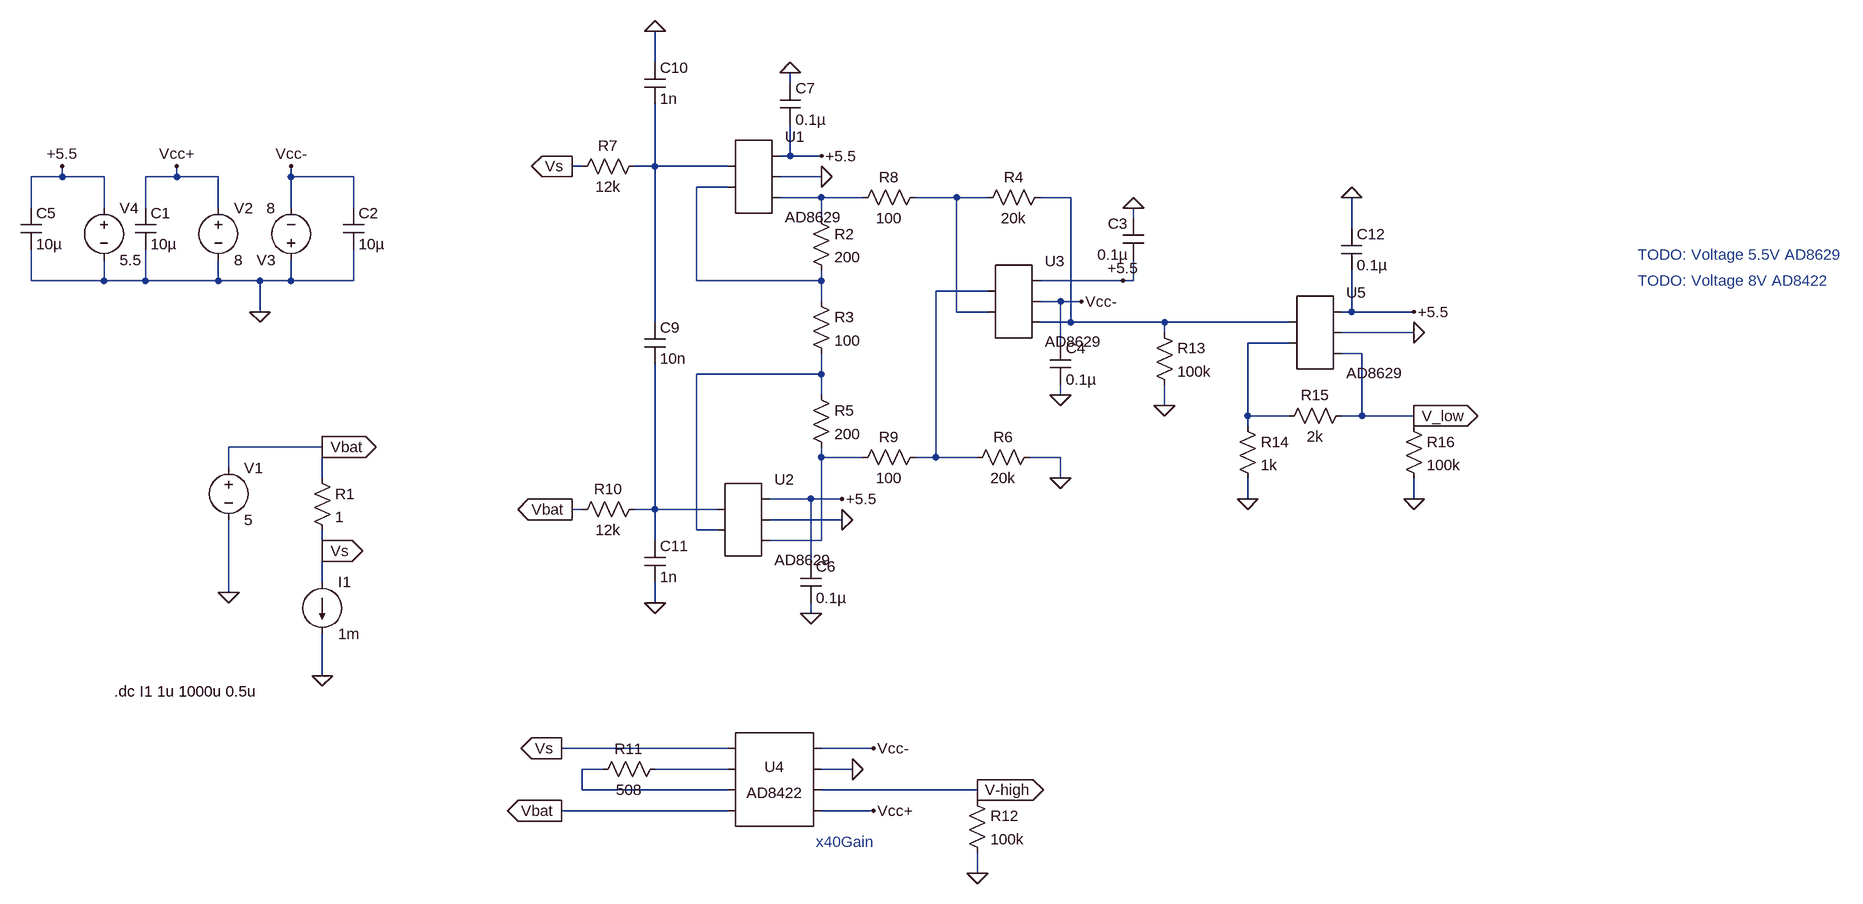
[diagram p0: schematic cm_AD8629.asc]
cm_AD8629.asc, the LTspice schematic file:
Version 4
SHEET 1 1660 912
WIRE -176 -720 -176 -768
WIRE 32 -688 32 -704
WIRE 32 -576 32 -624
WIRE 32 -576 16 -576
WIRE 80 -576 32 -576
WIRE -288 -560 -304 -560
WIRE -176 -560 -176 -656
WIRE -176 -560 -208 -560
WIRE -64 -560 -176 -560
WIRE -1088 -544 -1088 -560
WIRE -1088 -544 -1136 -544
WIRE -1024 -544 -1088 -544
WIRE -912 -544 -912 -560
WIRE -912 -544 -960 -544
WIRE -848 -544 -912 -544
WIRE -736 -544 -736 -560
WIRE -640 -544 -736 -544
WIRE 80 -544 16 -544
WIRE -64 -528 -112 -528
WIRE 80 -512 16 -512
WIRE 144 -512 80 -512
WIRE 288 -512 224 -512
WIRE 336 -512 288 -512
WIRE 464 -512 416 -512
WIRE -1136 -496 -1136 -544
WIRE -1024 -496 -1024 -544
WIRE -960 -496 -960 -544
WIRE -848 -496 -848 -544
WIRE -736 -496 -736 -544
WIRE -640 -496 -640 -544
WIRE 80 -480 80 -512
WIRE 560 -480 560 -496
WIRE 896 -464 896 -512
WIRE -1136 -384 -1136 -432
WIRE -1024 -384 -1024 -416
WIRE -1024 -384 -1136 -384
WIRE -960 -384 -960 -432
WIRE -960 -384 -1024 -384
WIRE -848 -384 -848 -416
WIRE -848 -384 -960 -384
WIRE -784 -384 -848 -384
WIRE -736 -384 -736 -416
WIRE -736 -384 -784 -384
WIRE -640 -384 -640 -432
WIRE -640 -384 -736 -384
WIRE -112 -384 -112 -528
WIRE 80 -384 80 -400
WIRE 80 -384 -112 -384
WIRE 544 -384 416 -384
WIRE 560 -384 560 -416
WIRE 560 -384 544 -384
WIRE 336 -368 256 -368
WIRE 80 -352 80 -384
WIRE 448 -352 416 -352
WIRE 480 -352 448 -352
WIRE -784 -336 -784 -384
WIRE 288 -336 288 -512
WIRE 336 -336 288 -336
WIRE 896 -336 896 -400
WIRE 896 -336 880 -336
WIRE 992 -336 896 -336
WIRE -176 -320 -176 -560
WIRE 464 -320 464 -512
WIRE 464 -320 416 -320
WIRE 608 -320 464 -320
WIRE 800 -320 608 -320
WIRE 608 -304 608 -320
WIRE 992 -304 880 -304
WIRE 448 -288 448 -352
WIRE 800 -288 736 -288
WIRE 912 -272 880 -272
WIRE 80 -240 80 -272
WIRE 80 -240 -112 -240
WIRE 80 -208 80 -240
WIRE 448 -208 448 -224
WIRE 608 -192 608 -224
WIRE 736 -176 736 -288
WIRE 800 -176 736 -176
WIRE 912 -176 912 -272
WIRE 912 -176 880 -176
WIRE 992 -176 912 -176
WIRE 736 -160 736 -176
WIRE 992 -160 992 -176
WIRE -688 -128 -832 -128
WIRE 80 -112 80 -128
WIRE 144 -112 80 -112
WIRE 256 -112 256 -368
WIRE 256 -112 224 -112
WIRE 320 -112 256 -112
WIRE 448 -112 400 -112
WIRE -832 -96 -832 -128
WIRE -688 -80 -688 -128
WIRE 448 -80 448 -112
WIRE 64 -48 0 -48
WIRE 112 -48 64 -48
WIRE 736 -48 736 -80
WIRE 992 -48 992 -80
WIRE -288 -32 -304 -32
WIRE -176 -32 -176 -256
WIRE -176 -32 -208 -32
WIRE -80 -32 -176 -32
WIRE 112 -16 0 -16
WIRE -112 0 -112 -240
WIRE -80 0 -112 0
WIRE -176 16 -176 -32
WIRE 80 16 80 -112
WIRE 80 16 0 16
WIRE -688 32 -688 0
WIRE 64 48 64 -48
WIRE -688 80 -688 32
WIRE -832 96 -832 -16
WIRE -176 112 -176 80
WIRE 64 128 64 112
WIRE -688 224 -688 160
WIRE -64 336 -320 336
WIRE 160 336 80 336
WIRE -256 368 -288 368
WIRE -64 368 -176 368
WIRE 128 368 80 368
WIRE -288 400 -288 368
WIRE -64 400 -288 400
WIRE 320 400 80 400
WIRE 320 416 320 400
WIRE -64 432 -320 432
WIRE 160 432 80 432
WIRE 320 528 320 496
FLAG -832 96 0
FLAG -688 224 0
FLAG -784 -336 0
FLAG -912 -560 Vcc+
FLAG -688 -128 Vbat
IOPIN -688 -128 Out
FLAG -688 32 Vs
IOPIN -688 32 Out
FLAG 112 -48 +5.5
FLAG 80 -576 +5.5
FLAG 544 -384 +5.5
FLAG 448 -80 0
FLAG -736 -560 Vcc-
FLAG 480 -352 Vcc-
FLAG -304 -32 Vbat
IOPIN -304 -32 Out
FLAG -304 -560 Vs
IOPIN -304 -560 Out
FLAG 80 -544 0
FLAG 112 -16 0
FLAG 560 -496 0
FLAG 448 -208 0
FLAG 64 128 0
FLAG 32 -704 0
FLAG 160 432 Vcc+
FLAG -320 336 Vs
IOPIN -320 336 Out
FLAG -320 432 Vbat
IOPIN -320 432 Out
FLAG 320 528 0
FLAG 128 368 0
FLAG 160 336 Vcc-
FLAG -176 112 0
FLAG -176 -768 0
FLAG 608 -192 0
FLAG 736 -48 0
FLAG 992 -336 +5.5
FLAG 992 -304 0
FLAG 992 -48 0
FLAG 896 -512 0
FLAG 992 -176 V_low
IOPIN 992 -176 Out
FLAG 320 400 V-high
IOPIN 320 400 Out
FLAG -1088 -560 +5.5
SYMBOL res -704 -96 R0
SYMATTR InstName R1
SYMATTR Value 1
SYMATTR SpiceLine tol=.1
SYMBOL voltage -832 -112 R0
WINDOW 123 0 0 Left 2
WINDOW 39 0 0 Left 2
SYMATTR InstName V1
SYMATTR Value 5
SYMBOL current -688 80 R0
WINDOW 123 0 0 Left 2
WINDOW 39 0 0 Left 2
SYMATTR InstName I1
SYMATTR Value 1m
SYMBOL voltage -848 -512 R0
WINDOW 123 0 0 Left 2
WINDOW 39 0 0 Left 2
SYMATTR InstName V2
SYMATTR Value 8
SYMBOL cap -976 -496 R0
SYMATTR InstName C1
SYMATTR Value 10µ
SYMBOL res 64 -496 R0
SYMATTR InstName R2
SYMATTR Value 200
SYMATTR SpiceLine tol=.1
SYMBOL res 64 -368 R0
SYMATTR InstName R3
SYMATTR Value 100
SYMATTR SpiceLine tol=.1
SYMBOL res 64 -224 R0
SYMATTR InstName R5
SYMATTR Value 200
SYMATTR SpiceLine tol=.1
SYMBOL res 240 -528 R90
WINDOW 0 0 56 VBottom 2
WINDOW 3 32 56 VTop 2
SYMATTR InstName R8
SYMATTR Value 100
SYMATTR SpiceLine tol=.1
SYMBOL res 240 -128 R90
WINDOW 0 0 56 VBottom 2
WINDOW 3 32 56 VTop 2
SYMATTR InstName R9
SYMATTR Value 100
SYMATTR SpiceLine tol=.1
SYMBOL res 432 -528 R90
WINDOW 0 0 56 VBottom 2
WINDOW 3 32 56 VTop 2
SYMATTR InstName R4
SYMATTR Value 20k
SYMATTR SpiceLine tol=.01
SYMBOL res 416 -128 R90
WINDOW 0 0 56 VBottom 2
WINDOW 3 32 56 VTop 2
SYMATTR InstName R6
SYMATTR Value 20k
SYMATTR SpiceLine tol=.01
SYMBOL voltage -736 -400 R180
WINDOW 123 0 0 Left 2
WINDOW 39 0 0 Left 2
SYMATTR InstName V3
SYMATTR Value 8
SYMBOL AutoGenerated\\AD8629 -32 -544 R0
SYMATTR InstName U1
SYMBOL AutoGenerated\\AD8629 -48 -16 R0
SYMATTR InstName U2
SYMBOL AutoGenerated\\AD8629 368 -352 R0
SYMATTR InstName U3
SYMBOL res -304 -544 R270
WINDOW 0 32 56 VTop 2
WINDOW 3 0 56 VBottom 2
SYMATTR InstName R7
SYMATTR Value 12k
SYMBOL res -192 -48 R90
WINDOW 0 0 56 VBottom 2
WINDOW 3 32 56 VTop 2
SYMATTR InstName R10
SYMATTR Value 12k
SYMBOL cap -656 -496 R0
SYMATTR InstName C2
SYMATTR Value 10µ
SYMBOL cap 576 -416 R180
WINDOW 0 24 56 Left 2
WINDOW 3 24 8 Left 2
SYMATTR InstName C3
SYMATTR Value 0.1µ
SYMBOL cap 432 -288 R0
SYMATTR InstName C4
SYMATTR Value 0.1µ
SYMBOL cap 48 48 R0
SYMATTR InstName C6
SYMATTR Value 0.1µ
SYMBOL cap 16 -688 R0
SYMATTR InstName C7
SYMATTR Value 0.1µ
SYMBOL res -160 352 R90
WINDOW 0 0 56 VBottom 2
WINDOW 3 32 56 VTop 2
SYMATTR InstName R11
SYMATTR Value 508
SYMATTR SpiceLine tol=0.1
SYMBOL AutoGenerated\\AD8422 0 384 R0
SYMATTR InstName U4
SYMBOL res 304 400 R0
SYMATTR InstName R12
SYMATTR Value 100k
SYMBOL cap -192 -320 R0
SYMATTR InstName C9
SYMATTR Value 10n
SYMBOL cap -192 -720 R0
SYMATTR InstName C10
SYMATTR Value 1n
SYMBOL cap -192 16 R0
SYMATTR InstName C11
SYMATTR Value 1n
SYMBOL res 592 -320 R0
SYMATTR InstName R13
SYMATTR Value 100k
SYMBOL AutoGenerated\\AD8629 832 -304 R0
SYMATTR InstName U5
SYMBOL res 720 -176 R0
SYMATTR InstName R14
SYMATTR Value 1k
SYMBOL res 896 -192 R90
WINDOW 0 0 56 VBottom 2
WINDOW 3 32 56 VTop 2
SYMATTR InstName R15
SYMATTR Value 2k
SYMBOL res 976 -176 R0
SYMATTR InstName R16
SYMATTR Value 100k
SYMBOL cap 880 -464 R0
SYMATTR InstName C12
SYMATTR Value 0.1µ
SYMBOL voltage -1024 -512 R0
WINDOW 123 0 0 Left 2
WINDOW 39 0 0 Left 2
SYMATTR InstName V4
SYMATTR Value 5.5
SYMBOL cap -1152 -496 R0
SYMATTR InstName C5
SYMATTR Value 10µ
TEXT -1008 248 Left 2 !.dc I1 1u 1000u 0.5u
TEXT 72 480 Left 2 ;x40Gain
TEXT 1336 -424 Left 2 ;TODO: Voltage 5.5V AD8629
TEXT 1336 -384 Left 2 ;TODO: Voltage 8V AD8422

The netlist it stands for:
* cm_AD8629.asc
R1 Vbat Vs 1 tol=.1
V1 Vbat 0 5
I1 Vs 0 1m
V2 Vcc+ 0 8
C1 Vcc+ 0 10µ
R2 N003 N002 200 tol=.1
R3 N002 N008 100 tol=.1
R5 N008 N009 200 tol=.1
R8 N004 N003 100 tol=.1
R9 N006 N009 100 tol=.1
R4 N005 N004 20k tol=.01
R6 0 N006 20k tol=.01
V3 0 Vcc- 8
* U1: AD8629 (symbol AutoGenerated\AD8629 not available, pins judged from their places): pin1=N001 pin2=N002 pin3=+5.5 pin4=0 pin5=N003
* U2: AD8629 (symbol AutoGenerated\AD8629 not available, pins judged from their places): pin1=N010 pin2=N008 pin3=+5.5 pin4=0 pin5=N009
* U3: AD8629 (symbol AutoGenerated\AD8629 not available, pins judged from their places): pin1=N006 pin2=N004 pin3=+5.5 pin4=Vcc- pin5=N005
R7 Vs N001 12k
R10 N010 Vbat 12k
C2 Vcc- 0 10µ
C3 +5.5 0 0.1µ
C4 Vcc- 0 0.1µ
C6 +5.5 0 0.1µ
C7 0 +5.5 0.1µ
R11 N012 N011 508 tol=0.1
* U4: AD8422 (symbol AutoGenerated\AD8422 not available, pins judged from their places): pin1=Vs pin2=N012 pin3=N011 pin4=Vbat pin5=Vcc- pin6=0 pin7=V-high pin8=Vcc+
R12 V-high 0 100k
C9 N001 N010 10n
C10 0 N001 1n
C11 N010 0 1n
R13 N005 0 100k
* U5: AD8629 (symbol AutoGenerated\AD8629 not available, pins judged from their places): pin1=N005 pin2=N007 pin3=+5.5 pin4=0 pin5=V_low
R14 N007 0 1k
R15 V_low N007 2k
R16 V_low 0 100k
C12 0 +5.5 0.1µ
V4 +5.5 0 5.5
C5 +5.5 0 10µ
.dc I1 1u 1000u 0.5u
* x40Gain
* TODO: Voltage 5.5V AD8629
* TODO: Voltage 8V AD8422
.backanno
.end